# EAGLE design V5.9SMD (EAGLE 7.6.0)
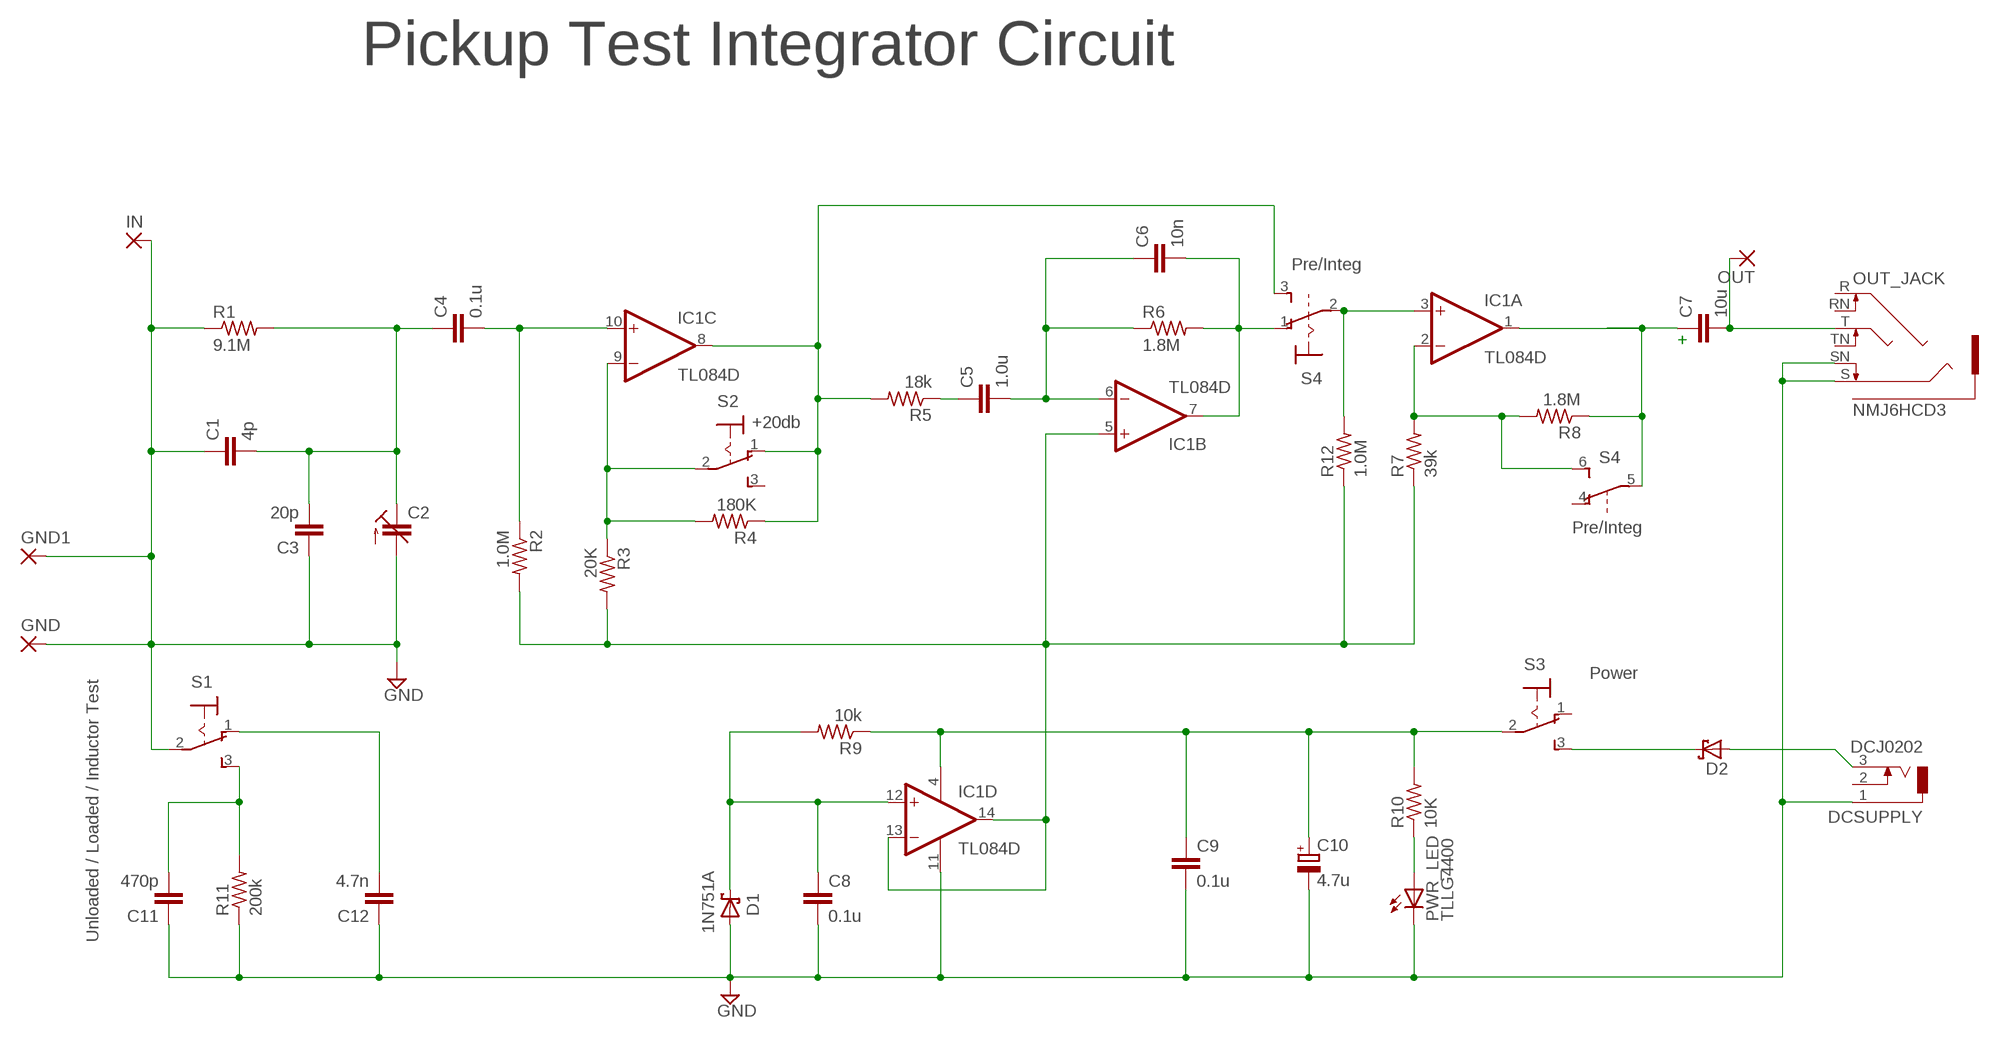
[diagram p0: schematic, sheet 1]

## Parts
C1  4p  C-EUC0805  [C0805]
C2  C-TRIMMGKG20015  [GKG20015]
C3  20p  C-EUC0805  [C0805]
C4  0.1u  C-EUC0805  [C0805]
C5  1.0u  C-EUC0805  [C0805]
C6  10n  C-EUC0805  [C0805]
C7  10u  C-EUC1206K  [C1206K]
C8  0.1u  C-EUC0805  [C0805]
C9  0.1u  C-EUC0805  [C0805]
C10  4.7u  CPOL-EUA/3216-18R  [A/3216-18R]
C11  470p  C-EUC0805  [C0805]
C12  4.7n  C-EUC0805  [C0805]
D1  BAS40  [SOT23]
D2  SCHOTTKY-DIODESMD  [SMB]
DCSUPPLY  DCJ0202  [DCJ0202]
GND  2,54/1,1  [2,54/1,1]
GND1  2,54/1,1  [2,54/1,1]
IC1  TL084D  [SO14]
IN  2,54/1,1  [2,54/1,1]
OUT  2,54/1,1  [2,54/1,1]
OUT_JACK  NMJ6HCD3  [AUDIO_JACK_NEUTRIK]
PWR_LED  TLLG4400  [LED3MM]
R1  9.1M  R-US_R0805  [R0805]
R2  1.0M  R-US_R0805  [R0805]
R3  20K  R-US_R0805  [R0805]
R4  180K  R-US_R0805  [R0805]
R5  18k  R-US_R0805  [R0805]
R6  1.8M  R-US_R0805  [R0805]
R7  39k  R-US_R0805  [R0805]
R8  1.8M  R-US_R0805  [R0805]
R9  10k  R-US_R0805  [R0805]
R10  10K  R-US_R0805  [R0805]
R11  200k  R-US_R0805  [R0805]
R12  1.0M  R-US_R0805  [R0805]
S1  320-916  [320-916]
S2  320-916  [320-916]
S3  320-916  [320-916]
S4  320-938  [320-938]

## Nets
GND: C1.1 C2.1(A) C3.1 C8.2 C9.2 C10.- C11.1 C12.1 D1.1(A) DCSUPPLY.1 GND1.1(P) GND.1(P) IC1.11(P:V-) IN.1(P) OUT_JACK.S OUT_JACK.SN PWR_LED.K(C) R1.1 R11.1 S1.2(P)
IT: C12.2 S1.1(O)
N$1: PWR_LED.A R10.1
N$2: C5.1 R5.1
N$3: D2.C S3.3(S)
N$4: IC1.8(C:OUT) R4.1 R5.2 S2.1(O) S4.3(1:S)
N$5: IC1.9(C:-IN) R3.1 R4.2 S2.2(P)
N$6: C6.2 IC1.7(B:OUT) R6.2 S4.1(1:O)
N$7: IC1.2(A:-IN) R7.2 R8.2 S4.6(B:S)
N$8: C7.1 IC1.1(A:OUT) R8.1 S4.5(B:P)
N$9: C1.2 C2.2(E) C3.2 C4.1 R1.2
N$10: C8.1 D1.3(C) IC1.12(D:+IN) R9.2
N$11: IC1.3(A:+IN) R12.2 S4.2(1:P)
N$12: C4.2 IC1.10(C:+IN) R2.1
N$14: IC1.5(B:+IN) IC1.13(D:-IN) IC1.14(D:OUT) R2.2 R3.2 R7.1 R12.1
N$15: C9.1 C10.+ IC1.4(P:V+) R9.1 R10.2 S3.2(P)
N$16: C11.2 R11.2 S1.3(S)
N$18: C5.2 C6.1 IC1.6(B:-IN) R6.1
N$21: D2.A DCSUPPLY.3
N$22: C7.2 OUT.1(P) OUT_JACK.T
Unconnected: DCSUPPLY.2 OUT_JACK.R OUT_JACK.RN OUT_JACK.TN S2.3(S) S3.1(O) S4.4(B:O)

## Notes on the sheet
- Pickup Test Integrator Circuit
- Pre/Integ
- +
- +20db
- Pre/Integ
- Power
- Unloaded / Loaded / Inductor Test

## Library data of the parts
C1 C3-C9 C11 C12 = rcl:C-EU: CAPACITOR, European symbol
C2 = rcl:C-TRIMM: Trimm capacitor
C10 = rcl:CPOL-EU: POLARIZED CAPACITOR, European symbol
D1 = diode:BAS40: Silicon Schottky Diodes General-purpose diode for high-speed switching
D2 = diode:SCHOTTKY-DIODE: Schottky Diode
DCSUPPLY = con-jack:DCJ0202: DC POWER JACK Source: DCJ0202.pdf; OC_FARNELL: unknown; OC_NEWARK: unknown
GND GND1 IN OUT = wirepad:2,54/1,1: THROUGH-HOLE PAD
IC1 = linear:TL084: OP AMP
OUT_JACK = Heliostat:NMJ6HCD3
PWR_LED = led:TLLG4400: Low Current (2mA) LED 3 mm Tinted Diffused Package color GREEN Source: Data sheet <http://www.farnell.com/datasheets/391098.pdf>; MF: VISHAY SEMICONDUCTOR; OC_FARNELL: 1612435
R1-R12 = rcl:R-US_: RESISTOR, American symbol
S1-S3 = switch:320-916: TOGGLE SWITCH distributor RS Components
S4 = switch:320-938: TOGGLE SWITCH distributor RS Components

## Board
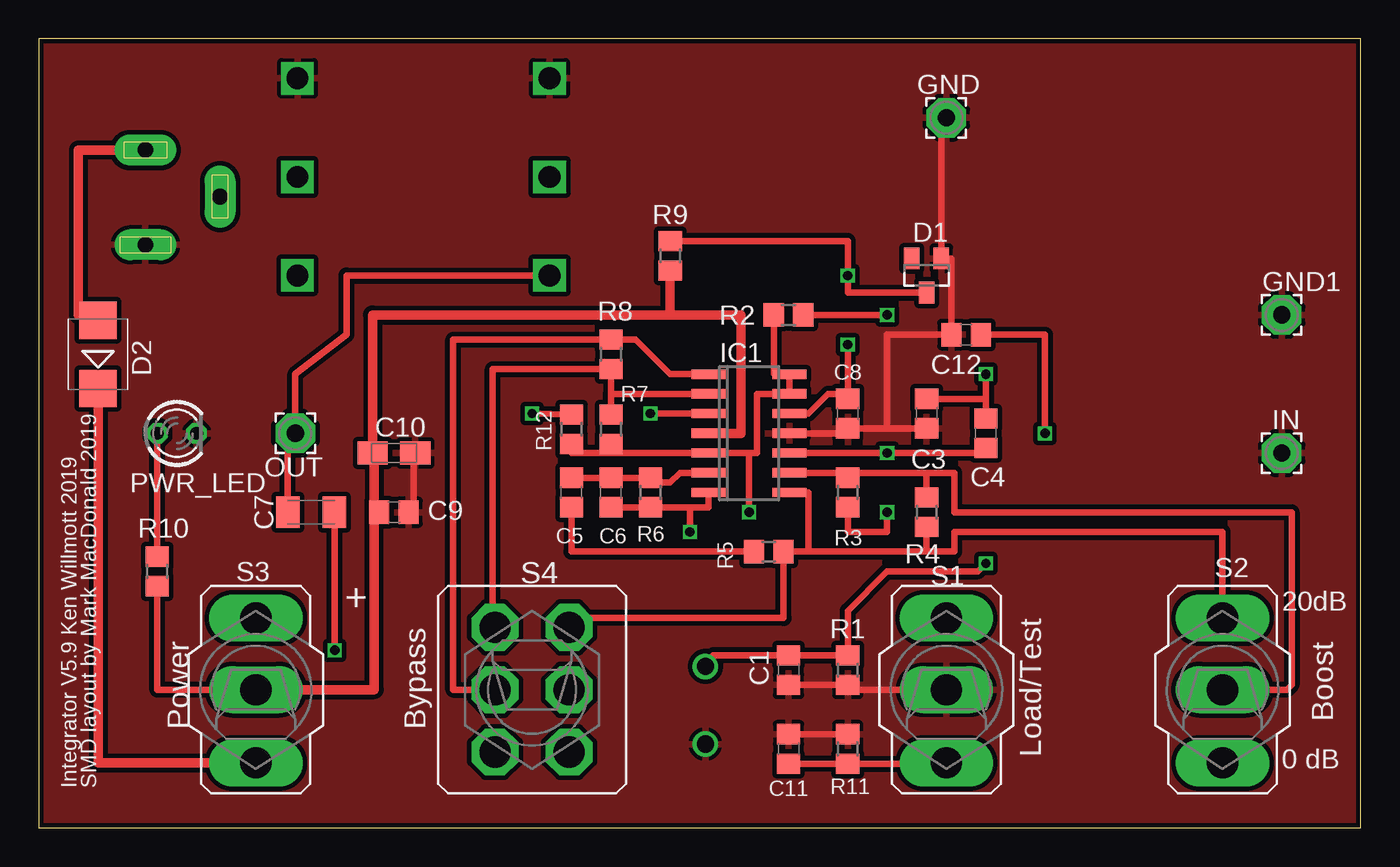
[diagram p1: board, top side]
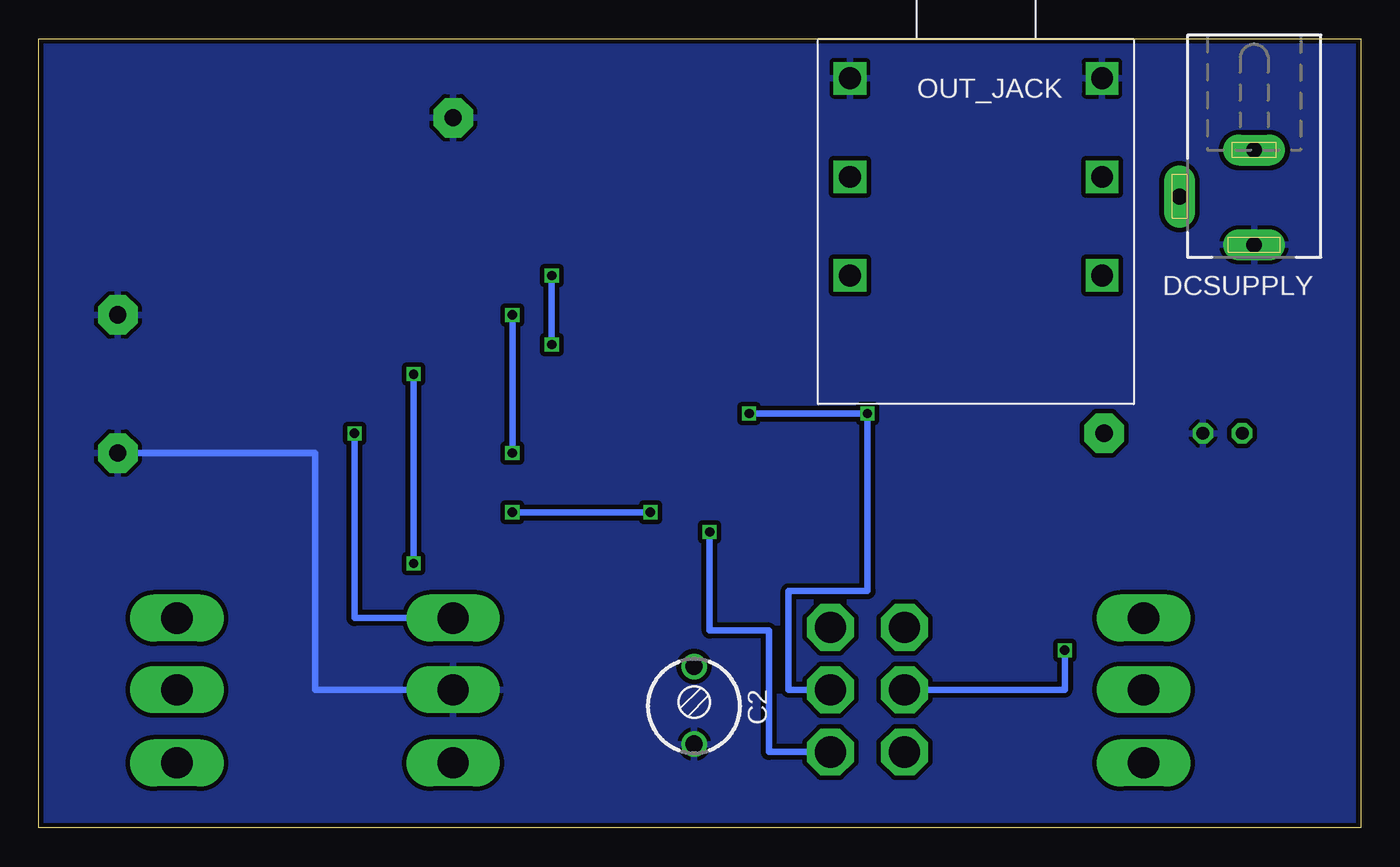
[diagram p2: board, bottom side, seen from below]

Size 85.09 x 50.8 mm. Coordinates in mm from the lower left corner, seen from the top.
Outline: 0,50.8 0,0 85.09,0 85.09,50.8 0,50.8
Copper layers (1*16): Top 0.035mm / dielectric 1.5mm / Bottom 0.035mm
Design rules "ITEADstudio_DRC": minimum track width 6mil, minimum drill 12mil, track to track 6mil, track to pad 6mil, pad to pad 6mil, via to via 6mil, smd to smd 0mil, copper to edge 10mil, drill to drill 10mil, minimum pad ring 10mil, minimum via ring 6mil, stop-mask expansion 2mil, vias tented up to drill 100mil, thermal gap 10mil

### Footprints (pad centres in the part's own frame; a part is rotated, then mirrored left to right if it is on the bottom)
C0805 = smd 1.3 x 1.5: 1 -0.95,0; 2 0.95,0
GKG20015 = drill 1.1: 1 -2.5,0; 2 2.5,0
C1206K = smd 1.5 x 2: 1 -1.5,0; 2 1.5,0
A/3216-18R = smd 1.95 x 1.5: + 1.375,0; - -1.375,0
SOT23 = smd 1 x 1.4: 1 -0.95,-1.1; 2 0.95,-1.1; 3 0,1.1
SMB = smd 2.4 x 2.4: A 2.2,0; C -2.2,0
DCJ0202 = drill 1 pad 2 long: 1 0,3.1; 2 4.8,0; 3 0,-3
2,54/1,1 = drill 1.118 pad 2.54 octagon: 1 0,0
SO14 = smd 0.6 x 2.2: 1 -3.81,-2.6; 2 -2.54,-2.6; 3 -1.27,-2.6; 4 0,-2.6; 5 1.27,-2.6; 6 2.54,-2.6; 7 3.81,-2.6; 8 3.81,2.6; 9 2.54,2.6; 10 1.27,2.6; 11 0,2.6; 12 -1.27,2.6; 13 -2.54,2.6; 14 -3.81,2.6
AUDIO_JACK_NEUTRIK = drill 1.4 square: R -8.115,0; RN 8.115,0; S -8.115,6.35; SN 8.115,6.35; T -8.115,-6.35; TN 8.115,-6.35
LED3MM = drill 0.813 octagon: A -1.27,0; K 1.27,0
R0805 = smd 1.3 x 1.5: 1 -0.95,0; 2 0.95,0
320-916 = drill 2.007 long: 1 0,4.613; 2 0,0; 3 0,-4.713
320-938 = drill 2.007 octagon: 1 -2.388,4.013; 2 -2.388,0; 3 -2.388,-4.013; 4 2.388,4.013; 5 2.388,0; 6 2.388,-4.013

### Placement (x,y rotation side)
C1  48.26,10.16 90 top
C2  42.91,7.89 90 bottom
C3  57.15,26.67 90 top
C4  60.96,25.4 270 top
C5  34.29,21.59 90 top
C6  36.83,21.59 270 top
C7  17.53,20.32 180 top
C8  52.07,26.67 270 top
C9  22.86,20.32 0 top
C10  22.86,24.13 180 top
C11  48.26,5.08 270 top
C12  59.69,31.75 0 top
D1  57.15,35.56 180 top
D2  3.81,30.48 90 top
DCSUPPLY  6.86,40.64 180 bottom
GND  58.42,45.72 0 top
GND1  80.01,33.02 0 top
IC1  45.72,25.4 270 top
IN  80.01,24.13 0 top
OUT  16.51,25.4 180 top
OUT_JACK  24.77,41.91 0 bottom
PWR_LED  8.89,25.4 0 top
R1  52.07,10.16 90 top
R2  48.26,33.02 180 top
R3  52.07,21.59 270 top
R4  57.15,20.32 90 top
R5  46.99,17.78 0 top
R6  39.37,21.59 270 top
R7  36.83,25.65 90 top
R8  36.83,30.48 270 top
R9  40.64,36.83 90 top
R10  7.62,16.51 270 top
R11  52.07,5.08 270 top
R12  34.29,25.65 90 top
S1  58.42,8.89 0 top
S2  76.2,8.89 0 top
S3  13.97,8.89 0 top
S4  31.75,8.89 180 top

### Tracks (layer width: path | path; a pad name or v marks a point on that pad's centre or on a via)
GND
  Top 0.406: IC1.11 51.75,25.4 C8.2 54.61,25.72 | R11.1 C11.1 | 54.61,25.72 C3.1 | 54.61,25.72 54.61,31.75 C12.1 58.74,36.66 D1.1 58.1,45.72 GND.1 | C9.2 24.13,20.32 24.13,24.13 C10.- | S1.2 52.39,8.89 R1.1 C1.1
  Bottom 0.406: S1.2 67.31,8.89 67.31,24.13 IN.1
  pour Bottom (isolate 0.305): 0,-1.27 0,53.34 86.36,53.34 86.36,-1.27
  pour Top (isolate 0.305): -2.54,-2.54 -2.54,53.34 88.9,53.34 88.9,-2.54
IT  (via drill 0.6)
  Top 0.406: C12.2 64.77,31.75 v64.77,25.4
  Bottom 0.406: S1.1 64.77,13.5 v64.77,25.4
N$1
  Top 0.406: R10.1 PWR_LED.A
N$2
  Top 0.406: C5.1 34.29,17.78 R5.1
N$3
  Top 0.61: D2.C 3.81,4.18 S3.3
N$4
  Top 0.406: 49.53,17.78 R5.2 47.94,13.5 34.14,13.5 S4.3 | 49.53,17.78 49.53,21.59 IC1.8 | 49.53,17.78 57.15,17.78 | 57.15,17.78 58.93,17.78 58.93,19.05 76.2,19.05 S2.1 | R4.1 57.15,17.78
N$5
  Top 0.406: IC1.9 52.39,22.86 R3.1 52.07,22.86 57.15,22.86 | 57.15,22.86 58.93,22.86 58.93,20.32 80.64,20.32 80.64,9.21 80.33,8.89 S2.2 | R4.2 57.15,22.86
N$6  (via drill 0.6)
  Top 0.406: C6.2 R6.2 41.91,20.64 | 41.91,20.64 43.12,20.64 IC1.7 | v41.91,19.05 41.91,20.64
  Bottom 0.406: S4.1 38.1,4.88 38.1,12.7 41.91,12.7 v41.91,19.05
N$7
  Top 0.406: IC1.2 36.83,27.94 R7.2 R8.2 29.21,29.53 29.21,12.9 S4.6
N$8  (via drill 0.6)
  Top 0.406: IC1.1 40.64,29.21 38.42,31.43 R8.1 26.67,31.43 26.67,8.89 S4.5 | v19.05,11.43 19.05,20.32 C7.1
  Bottom 0.406: v19.05,11.43 19.05,8.89 S4.5
N$9  (via drill 0.6)
  Top 0.406: C4.1 60.96,27.62 | 60.96,27.62 C3.2 | v60.96,29.21 60.96,27.62 | C2.2 43.41,11.11 C1.2 R1.2 52.07,13.97 54.61,16.51 60.45,16.51 v60.96,17.02
  Bottom 0.406: v60.96,17.02 v60.96,29.21
N$10  (via drill 0.6)
  Top 0.406: C8.1 51.75,27.94 | 51.75,27.94 50.8,27.94 49.53,26.67 IC1.12 | 51.75,27.94 52.07,27.94 v52.07,31.11 | R9.2 52.07,37.78 v52.07,35.56 52.07,34.46 D1.3
  Bottom 0.406: v52.07,31.11 v52.07,35.56
N$11  (via drill 0.6)
  Top 0.406: IC1.3 v39.37,26.67 | v31.75,26.67 R12.2
  Bottom 0.406: v39.37,26.67 v31.75,26.67 31.75,15.24 36.83,15.24 36.83,8.89 S4.2
N$12  (via drill 0.6)
  Top 0.406: IC1.10 v54.61,24.13 60.64,24.13 C4.2 | v54.61,33.02 R2.1
  Bottom 0.406: v54.61,24.13 v54.61,33.02
N$14  (via drill 0.6)
  Top 0.406: 45.72,24.13 IC1.5 37.15,24.13 | 45.72,24.13 46.23,24.13 46.23,27.94 IC1.13 IC1.14 47.31,29.21 R2.2 | 37.15,24.13 R7.1 | R3.2 52.07,19.05 54.61,19.05 v54.61,20.32 | v45.72,20.32 45.72,24.13 | 37.15,24.13 34.29,24.13 R12.1
  Bottom 0.406: v54.61,20.32 v45.72,20.32
N$15
  Top 0.406: S3.2 7.62,8.89 R10.2 | C10.+ 21.59,24.13 | 21.59,20.32 C9.1
  Top 0.61: S3.2 21.59,8.89 21.59,20.32 21.59,24.13 | 40.64,33.02 21.48,33.02 C10.+ | 40.64,33.02 R9.1 | IC1.4 45.21,25.4 45.21,33.02 40.64,33.02
N$16
  Top 0.406: S1.3 60.96,4.13 R11.2 C11.2
N$18
  Top 0.406: IC1.6 41.27,22.86 40.64,22.23 39.69,22.23 R6.1 C6.1 C5.2
N$21
  Top 0.406: 3.81,33.02 D2.A
  Top 0.61: DCSUPPLY.3 2.54,43.64 2.54,33.02 3.81,33.02
N$22
  Top 0.406: C7.2 16,20.32 16,24.38 OUT.1 16.51,29.21 19.81,31.75 19.81,35.56 OUT_JACK.T

### Text on the board
tPlace: Boost | Power | Bypass | Load/Test
tNames: + | 20dB | 0 dB | Integrator V5.9 Ken Willmott 2019 | SMD layout by Mark MacDonald 2019